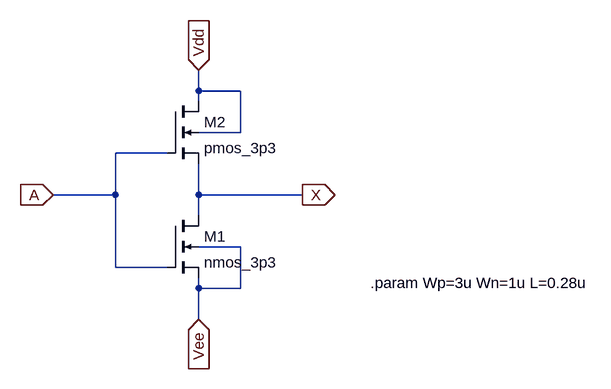
[diagram p0: schematic INVx1.asc]
INVx1.asc, the LTspice schematic file:
Version 4
SHEET 1 2776 836
WIRE 416 -16 416 -48
WIRE 480 -16 416 -16
WIRE 416 0 416 -16
WIRE 480 48 480 -16
WIRE 480 48 416 48
WIRE 368 80 288 80
WIRE 288 144 288 80
WIRE 288 144 192 144
WIRE 416 144 416 96
WIRE 576 144 416 144
WIRE 416 176 416 144
WIRE 480 224 416 224
WIRE 288 256 288 144
WIRE 368 256 288 256
WIRE 416 288 416 272
WIRE 480 288 480 224
WIRE 480 288 416 288
WIRE 416 336 416 288
FLAG 416 -48 Vdd
IOPIN 416 -48 In
FLAG 192 144 A
IOPIN 192 144 In
FLAG 576 144 X
IOPIN 576 144 Out
FLAG 416 336 Vee
IOPIN 416 336 In
SYMBOL nmos4 368 176 R0
SYMATTR InstName M1
SYMATTR Value nmos_3p3
SYMATTR Value2 l={L} w={Wn}
SYMBOL nmos4 368 0 R0
SYMATTR InstName M2
SYMATTR Value pmos_3p3
SYMATTR Value2 l={L} w={Wp}
TEXT 680 280 Left 2 !.param Wp=3u Wn=1u L=0.28u

The netlist it stands for:
* INVx1.asc
M1 X A Vee Vee nmos_3p3 l={L} w={Wn}
M2 Vdd A X Vdd pmos_3p3 l={L} w={Wp}
.model NMOS NMOS
.model PMOS PMOS
.lib standard.mos
.param Wp=3u Wn=1u L=0.28u
.backanno
.end